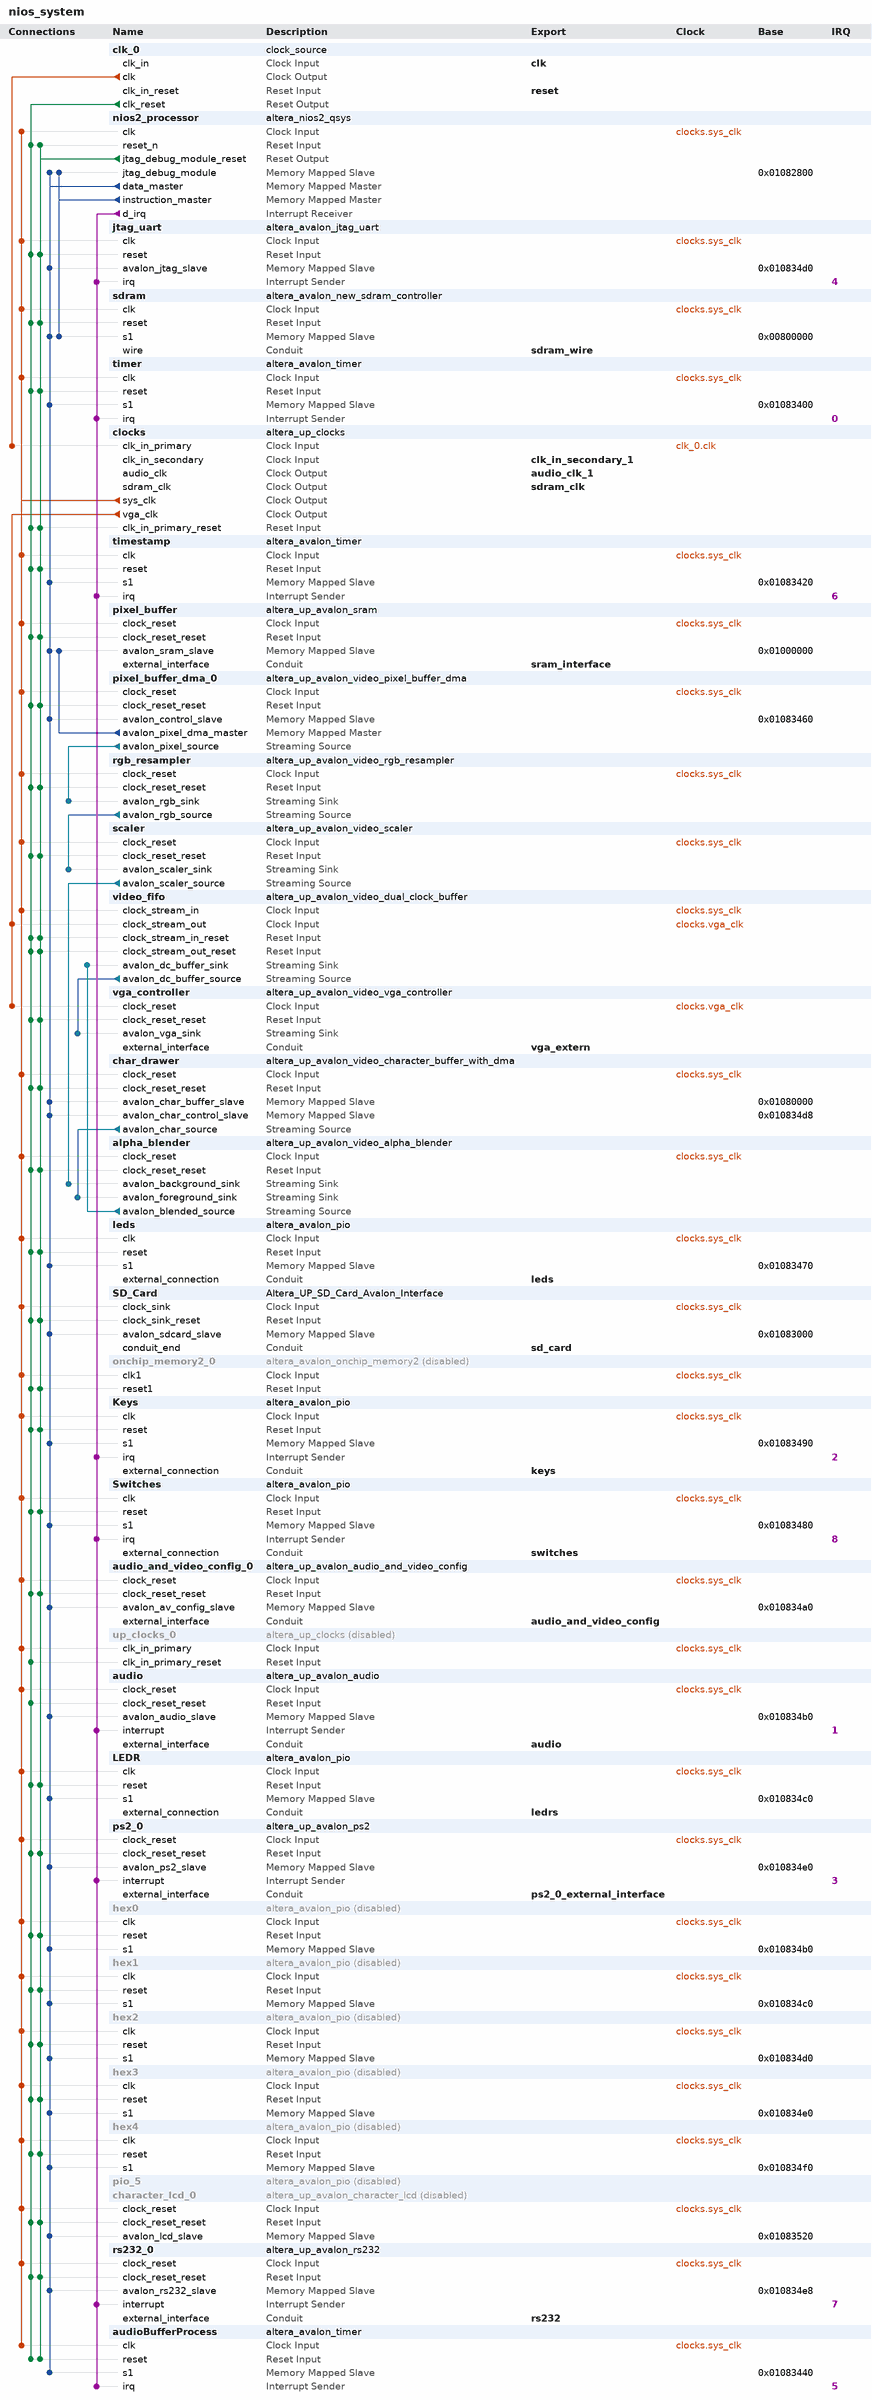
[diagram p0: system contents]
# Platform Designer (Qsys) system nios_system, Cyclone II EP2C35F672C6
# Parameters at their usual value, and those the tool derives, are not listed.
package require -exact qsys 12.0
create_system nios_system
set_project_property DEVICE_FAMILY {Cyclone II}
set_project_property DEVICE EP2C35F672C6

add_instance clk_0 clock_source 12.0
set_instance_parameter_value clk_0 clockFrequency 50000000

add_instance nios2_processor altera_nios2_qsys 12.0
set_instance_parameter_value nios2_processor resetSlave sdram.s1
set_instance_parameter_value nios2_processor exceptionSlave sdram.s1
set_instance_parameter_value nios2_processor breakSlave nios2_processor.jtag_debug_module
set_instance_parameter_value nios2_processor impl Fast
set_instance_parameter_value nios2_processor icache_size 8192
set_instance_parameter_value nios2_processor dcache_size 16384

add_instance jtag_uart altera_avalon_jtag_uart 12.0
set_instance_parameter_value jtag_uart simInteractiveOptions INTERACTIVE_ASCII_OUTPUT

add_instance sdram altera_avalon_new_sdram_controller 12.0
set_instance_parameter_value sdram TAC 5.5
set_instance_parameter_value sdram TRCD 20.0
set_instance_parameter_value sdram TRP 20.0
set_instance_parameter_value sdram casLatency 3
set_instance_parameter_value sdram columnWidth 8
set_instance_parameter_value sdram dataWidth 16
set_instance_parameter_value sdram generateSimulationModel false
set_instance_parameter_value sdram model custom
set_instance_parameter_value sdram numberOfBanks 4
set_instance_parameter_value sdram numberOfChipSelects 1
set_instance_parameter_value sdram powerUpDelay 100.0
set_instance_parameter_value sdram refreshPeriod 15.625
set_instance_parameter_value sdram rowWidth 12

add_instance timer altera_avalon_timer 12.0
set_instance_parameter_value timer period 1
set_instance_parameter_value timer periodUnits MSEC
set_instance_parameter_value timer timerPreset FULL_FEATURED

add_instance clocks altera_up_clocks 12.0
set_instance_parameter_value clocks board DE2
set_instance_parameter_value clocks vga_clk true
set_instance_parameter_value clocks audio_clk true
set_instance_parameter_value clocks audio_clk_freq 12.288

add_instance timestamp altera_avalon_timer 12.0
set_instance_parameter_value timestamp period 1
set_instance_parameter_value timestamp periodUnits MSEC
set_instance_parameter_value timestamp timerPreset FULL_FEATURED

add_instance pixel_buffer altera_up_avalon_sram 12.0
set_instance_parameter_value pixel_buffer board DE2
set_instance_parameter_value pixel_buffer pixel_buffer true

add_instance pixel_buffer_dma_0 altera_up_avalon_video_pixel_buffer_dma 12.0
set_instance_parameter_value pixel_buffer_dma_0 addr_mode Consecutive
set_instance_parameter_value pixel_buffer_dma_0 start_address 0
set_instance_parameter_value pixel_buffer_dma_0 back_start_address 0
set_instance_parameter_value pixel_buffer_dma_0 image_width 320
set_instance_parameter_value pixel_buffer_dma_0 image_height 240
set_instance_parameter_value pixel_buffer_dma_0 color_space {16-bit RGB}

add_instance rgb_resampler altera_up_avalon_video_rgb_resampler 12.0
set_instance_parameter_value rgb_resampler input_type {16-bit RGB}
set_instance_parameter_value rgb_resampler output_type {30-bit RGB}
set_instance_parameter_value rgb_resampler alpha 1023

add_instance scaler altera_up_avalon_video_scaler 12.0
set_instance_parameter_value scaler width_scaling 2
set_instance_parameter_value scaler height_scaling 2
set_instance_parameter_value scaler width_in 320
set_instance_parameter_value scaler color_bits 10
set_instance_parameter_value scaler color_planes 3

add_instance video_fifo altera_up_avalon_video_dual_clock_buffer 12.0
set_instance_parameter_value video_fifo color_bits 10

add_instance vga_controller altera_up_avalon_video_vga_controller 12.0
set_instance_parameter_value vga_controller board DE2

add_instance char_drawer altera_up_avalon_video_character_buffer_with_dma 12.0
set_instance_parameter_value char_drawer enable_transparency true

add_instance alpha_blender altera_up_avalon_video_alpha_blender 12.0

add_instance leds altera_avalon_pio 12.0
set_instance_parameter_value leds direction Output
set_instance_parameter_value leds width 8

add_instance SD_Card Altera_UP_SD_Card_Avalon_Interface 1.0

add_instance onchip_memory2_0 altera_avalon_onchip_memory2 12.0
set_instance_property onchip_memory2_0 ENABLED false
set_instance_parameter_value onchip_memory2_0 dataWidth 16
set_instance_parameter_value onchip_memory2_0 dualPort false
set_instance_parameter_value onchip_memory2_0 initMemContent true
set_instance_parameter_value onchip_memory2_0 initializationFileName onchip_memory2_0
set_instance_parameter_value onchip_memory2_0 memorySize 4096

add_instance Keys altera_avalon_pio 12.0
set_instance_parameter_value Keys captureEdge true
set_instance_parameter_value Keys direction Input
set_instance_parameter_value Keys edgeType ANY
set_instance_parameter_value Keys generateIRQ true
set_instance_parameter_value Keys irqType EDGE
set_instance_parameter_value Keys width 4

add_instance Switches altera_avalon_pio 12.0
set_instance_parameter_value Switches captureEdge true
set_instance_parameter_value Switches direction Input
set_instance_parameter_value Switches edgeType ANY
set_instance_parameter_value Switches generateIRQ true
set_instance_parameter_value Switches irqType EDGE
set_instance_parameter_value Switches width 8

add_instance audio_and_video_config_0 altera_up_avalon_audio_and_video_config 12.0
set_instance_parameter_value audio_and_video_config_0 board DE2
set_instance_parameter_value audio_and_video_config_0 audio_in {Microphone to ADC}
set_instance_parameter_value audio_and_video_config_0 line_in_bypass false
set_instance_parameter_value audio_and_video_config_0 bit_length 24
set_instance_parameter_value audio_and_video_config_0 sampling_rate {32 kHz}

add_instance up_clocks_0 altera_up_clocks 12.0
set_instance_property up_clocks_0 ENABLED false
set_instance_parameter_value up_clocks_0 board DE2
set_instance_parameter_value up_clocks_0 sdram_clk false
set_instance_parameter_value up_clocks_0 vga_clk false
set_instance_parameter_value up_clocks_0 audio_clk true
set_instance_parameter_value up_clocks_0 audio_clk_freq 12.288

add_instance audio altera_up_avalon_audio 12.0
set_instance_parameter_value audio avalon_bus_type {Memory Mapped}
set_instance_parameter_value audio audio_in true
set_instance_parameter_value audio dw 24

add_instance LEDR altera_avalon_pio 12.0
set_instance_parameter_value LEDR direction Output
set_instance_parameter_value LEDR width 18

add_instance ps2_0 altera_up_avalon_ps2 12.0

add_instance hex0 altera_avalon_pio 12.0
set_instance_property hex0 ENABLED false
set_instance_parameter_value hex0 direction Output
set_instance_parameter_value hex0 width 8

add_instance hex1 altera_avalon_pio 12.0
set_instance_property hex1 ENABLED false
set_instance_parameter_value hex1 direction Output
set_instance_parameter_value hex1 width 8

add_instance hex2 altera_avalon_pio 12.0
set_instance_property hex2 ENABLED false
set_instance_parameter_value hex2 direction Output
set_instance_parameter_value hex2 width 8

add_instance hex3 altera_avalon_pio 12.0
set_instance_property hex3 ENABLED false
set_instance_parameter_value hex3 direction Output
set_instance_parameter_value hex3 width 8

add_instance hex4 altera_avalon_pio 12.0
set_instance_property hex4 ENABLED false
set_instance_parameter_value hex4 direction Output
set_instance_parameter_value hex4 width 8

add_instance pio_5 altera_avalon_pio 12.0
set_instance_property pio_5 ENABLED false
set_instance_parameter_value pio_5 direction Output
set_instance_parameter_value pio_5 width 8

add_instance character_lcd_0 altera_up_avalon_character_lcd 12.0
set_instance_property character_lcd_0 ENABLED false
set_instance_parameter_value character_lcd_0 cursor Normal

add_instance rs232_0 altera_up_avalon_rs232 12.0
set_instance_parameter_value rs232_0 baud 115200
set_instance_parameter_value rs232_0 parity None

add_instance audioBufferProcess altera_avalon_timer 12.0
set_instance_parameter_value audioBufferProcess period 1
set_instance_parameter_value audioBufferProcess periodUnits MSEC
set_instance_parameter_value audioBufferProcess timerPreset FULL_FEATURED

# connections
add_connection clk_0.clk clocks.clk_in_primary clock
add_connection clocks.sys_clk alpha_blender.clock_reset clock
add_connection clocks.sys_clk audio.clock_reset clock
add_connection clocks.sys_clk audio_and_video_config_0.clock_reset clock
add_connection clocks.sys_clk audioBufferProcess.clk clock
add_connection clocks.sys_clk char_drawer.clock_reset clock
add_connection clocks.sys_clk character_lcd_0.clock_reset clock
add_connection clocks.sys_clk hex0.clk clock
add_connection clocks.sys_clk hex1.clk clock
add_connection clocks.sys_clk hex2.clk clock
add_connection clocks.sys_clk hex3.clk clock
add_connection clocks.sys_clk hex4.clk clock
add_connection clocks.sys_clk jtag_uart.clk clock
add_connection clocks.sys_clk Keys.clk clock
add_connection clocks.sys_clk LEDR.clk clock
add_connection clocks.sys_clk leds.clk clock
add_connection clocks.sys_clk nios2_processor.clk clock
add_connection clocks.sys_clk onchip_memory2_0.clk1 clock
add_connection clocks.sys_clk pixel_buffer.clock_reset clock
add_connection clocks.sys_clk pixel_buffer_dma_0.clock_reset clock
add_connection clocks.sys_clk ps2_0.clock_reset clock
add_connection clocks.sys_clk rgb_resampler.clock_reset clock
add_connection clocks.sys_clk rs232_0.clock_reset clock
add_connection clocks.sys_clk scaler.clock_reset clock
add_connection clocks.sys_clk SD_Card.clock_sink clock
add_connection clocks.sys_clk sdram.clk clock
add_connection clocks.sys_clk Switches.clk clock
add_connection clocks.sys_clk timer.clk clock
add_connection clocks.sys_clk timestamp.clk clock
add_connection clocks.sys_clk up_clocks_0.clk_in_primary clock
add_connection clocks.sys_clk video_fifo.clock_stream_in clock
add_connection clocks.vga_clk vga_controller.clock_reset clock
add_connection clocks.vga_clk video_fifo.clock_stream_out clock
add_connection clk_0.clk_reset alpha_blender.clock_reset_reset reset
add_connection clk_0.clk_reset audio.clock_reset_reset reset
add_connection clk_0.clk_reset audio_and_video_config_0.clock_reset_reset reset
add_connection clk_0.clk_reset audioBufferProcess.reset reset
add_connection clk_0.clk_reset char_drawer.clock_reset_reset reset
add_connection clk_0.clk_reset character_lcd_0.clock_reset_reset reset
add_connection clk_0.clk_reset clocks.clk_in_primary_reset reset
add_connection clk_0.clk_reset hex0.reset reset
add_connection clk_0.clk_reset hex1.reset reset
add_connection clk_0.clk_reset hex2.reset reset
add_connection clk_0.clk_reset hex3.reset reset
add_connection clk_0.clk_reset hex4.reset reset
add_connection clk_0.clk_reset jtag_uart.reset reset
add_connection clk_0.clk_reset Keys.reset reset
add_connection clk_0.clk_reset LEDR.reset reset
add_connection clk_0.clk_reset leds.reset reset
add_connection clk_0.clk_reset nios2_processor.reset_n reset
add_connection clk_0.clk_reset onchip_memory2_0.reset1 reset
add_connection clk_0.clk_reset pixel_buffer.clock_reset_reset reset
add_connection clk_0.clk_reset pixel_buffer_dma_0.clock_reset_reset reset
add_connection clk_0.clk_reset ps2_0.clock_reset_reset reset
add_connection clk_0.clk_reset rgb_resampler.clock_reset_reset reset
add_connection clk_0.clk_reset rs232_0.clock_reset_reset reset
add_connection clk_0.clk_reset scaler.clock_reset_reset reset
add_connection clk_0.clk_reset SD_Card.clock_sink_reset reset
add_connection clk_0.clk_reset sdram.reset reset
add_connection clk_0.clk_reset Switches.reset reset
add_connection clk_0.clk_reset timer.reset reset
add_connection clk_0.clk_reset timestamp.reset reset
add_connection clk_0.clk_reset up_clocks_0.clk_in_primary_reset reset
add_connection clk_0.clk_reset vga_controller.clock_reset_reset reset
add_connection clk_0.clk_reset video_fifo.clock_stream_in_reset reset
add_connection clk_0.clk_reset video_fifo.clock_stream_out_reset reset
add_connection nios2_processor.jtag_debug_module_reset alpha_blender.clock_reset_reset reset
add_connection nios2_processor.jtag_debug_module_reset audio_and_video_config_0.clock_reset_reset reset
add_connection nios2_processor.jtag_debug_module_reset audioBufferProcess.reset reset
add_connection nios2_processor.jtag_debug_module_reset char_drawer.clock_reset_reset reset
add_connection nios2_processor.jtag_debug_module_reset character_lcd_0.clock_reset_reset reset
add_connection nios2_processor.jtag_debug_module_reset clocks.clk_in_primary_reset reset
add_connection nios2_processor.jtag_debug_module_reset hex0.reset reset
add_connection nios2_processor.jtag_debug_module_reset hex1.reset reset
add_connection nios2_processor.jtag_debug_module_reset hex2.reset reset
add_connection nios2_processor.jtag_debug_module_reset hex3.reset reset
add_connection nios2_processor.jtag_debug_module_reset hex4.reset reset
add_connection nios2_processor.jtag_debug_module_reset jtag_uart.reset reset
add_connection nios2_processor.jtag_debug_module_reset Keys.reset reset
add_connection nios2_processor.jtag_debug_module_reset LEDR.reset reset
add_connection nios2_processor.jtag_debug_module_reset leds.reset reset
add_connection nios2_processor.jtag_debug_module_reset nios2_processor.reset_n reset
add_connection nios2_processor.jtag_debug_module_reset onchip_memory2_0.reset1 reset
add_connection nios2_processor.jtag_debug_module_reset pixel_buffer.clock_reset_reset reset
add_connection nios2_processor.jtag_debug_module_reset pixel_buffer_dma_0.clock_reset_reset reset
add_connection nios2_processor.jtag_debug_module_reset ps2_0.clock_reset_reset reset
add_connection nios2_processor.jtag_debug_module_reset rgb_resampler.clock_reset_reset reset
add_connection nios2_processor.jtag_debug_module_reset rs232_0.clock_reset_reset reset
add_connection nios2_processor.jtag_debug_module_reset scaler.clock_reset_reset reset
add_connection nios2_processor.jtag_debug_module_reset SD_Card.clock_sink_reset reset
add_connection nios2_processor.jtag_debug_module_reset sdram.reset reset
add_connection nios2_processor.jtag_debug_module_reset Switches.reset reset
add_connection nios2_processor.jtag_debug_module_reset timer.reset reset
add_connection nios2_processor.jtag_debug_module_reset timestamp.reset reset
add_connection nios2_processor.jtag_debug_module_reset vga_controller.clock_reset_reset reset
add_connection nios2_processor.jtag_debug_module_reset video_fifo.clock_stream_in_reset reset
add_connection nios2_processor.jtag_debug_module_reset video_fifo.clock_stream_out_reset reset
add_connection nios2_processor.data_master audio.avalon_audio_slave avalon
set_connection_parameter_value nios2_processor.data_master/audio.avalon_audio_slave baseAddress 0x010834b0
add_connection nios2_processor.data_master audio_and_video_config_0.avalon_av_config_slave avalon
set_connection_parameter_value nios2_processor.data_master/audio_and_video_config_0.avalon_av_config_slave baseAddress 0x010834a0
add_connection nios2_processor.data_master audioBufferProcess.s1 avalon
set_connection_parameter_value nios2_processor.data_master/audioBufferProcess.s1 baseAddress 0x01083440
add_connection nios2_processor.data_master char_drawer.avalon_char_buffer_slave avalon
set_connection_parameter_value nios2_processor.data_master/char_drawer.avalon_char_buffer_slave baseAddress 0x01080000
add_connection nios2_processor.data_master char_drawer.avalon_char_control_slave avalon
set_connection_parameter_value nios2_processor.data_master/char_drawer.avalon_char_control_slave baseAddress 0x010834d8
add_connection nios2_processor.data_master character_lcd_0.avalon_lcd_slave avalon
set_connection_parameter_value nios2_processor.data_master/character_lcd_0.avalon_lcd_slave baseAddress 0x01083520
add_connection nios2_processor.data_master hex0.s1 avalon
set_connection_parameter_value nios2_processor.data_master/hex0.s1 baseAddress 0x010834b0
add_connection nios2_processor.data_master hex1.s1 avalon
set_connection_parameter_value nios2_processor.data_master/hex1.s1 baseAddress 0x010834c0
add_connection nios2_processor.data_master hex2.s1 avalon
set_connection_parameter_value nios2_processor.data_master/hex2.s1 baseAddress 0x010834d0
add_connection nios2_processor.data_master hex3.s1 avalon
set_connection_parameter_value nios2_processor.data_master/hex3.s1 baseAddress 0x010834e0
add_connection nios2_processor.data_master hex4.s1 avalon
set_connection_parameter_value nios2_processor.data_master/hex4.s1 baseAddress 0x010834f0
add_connection nios2_processor.data_master jtag_uart.avalon_jtag_slave avalon
set_connection_parameter_value nios2_processor.data_master/jtag_uart.avalon_jtag_slave baseAddress 0x010834d0
add_connection nios2_processor.data_master Keys.s1 avalon
set_connection_parameter_value nios2_processor.data_master/Keys.s1 baseAddress 0x01083490
add_connection nios2_processor.data_master LEDR.s1 avalon
set_connection_parameter_value nios2_processor.data_master/LEDR.s1 baseAddress 0x010834c0
add_connection nios2_processor.data_master leds.s1 avalon
set_connection_parameter_value nios2_processor.data_master/leds.s1 baseAddress 0x01083470
add_connection nios2_processor.data_master nios2_processor.jtag_debug_module avalon
set_connection_parameter_value nios2_processor.data_master/nios2_processor.jtag_debug_module baseAddress 0x01082800
add_connection nios2_processor.data_master pixel_buffer.avalon_sram_slave avalon
set_connection_parameter_value nios2_processor.data_master/pixel_buffer.avalon_sram_slave baseAddress 0x01000000
add_connection nios2_processor.data_master pixel_buffer_dma_0.avalon_control_slave avalon
set_connection_parameter_value nios2_processor.data_master/pixel_buffer_dma_0.avalon_control_slave baseAddress 0x01083460
add_connection nios2_processor.data_master ps2_0.avalon_ps2_slave avalon
set_connection_parameter_value nios2_processor.data_master/ps2_0.avalon_ps2_slave baseAddress 0x010834e0
add_connection nios2_processor.data_master rs232_0.avalon_rs232_slave avalon
set_connection_parameter_value nios2_processor.data_master/rs232_0.avalon_rs232_slave baseAddress 0x010834e8
add_connection nios2_processor.data_master SD_Card.avalon_sdcard_slave avalon
set_connection_parameter_value nios2_processor.data_master/SD_Card.avalon_sdcard_slave baseAddress 0x01083000
add_connection nios2_processor.data_master sdram.s1 avalon
set_connection_parameter_value nios2_processor.data_master/sdram.s1 baseAddress 0x00800000
add_connection nios2_processor.data_master Switches.s1 avalon
set_connection_parameter_value nios2_processor.data_master/Switches.s1 baseAddress 0x01083480
add_connection nios2_processor.data_master timer.s1 avalon
set_connection_parameter_value nios2_processor.data_master/timer.s1 baseAddress 0x01083400
add_connection nios2_processor.data_master timestamp.s1 avalon
set_connection_parameter_value nios2_processor.data_master/timestamp.s1 baseAddress 0x01083420
add_connection nios2_processor.instruction_master nios2_processor.jtag_debug_module avalon
set_connection_parameter_value nios2_processor.instruction_master/nios2_processor.jtag_debug_module baseAddress 0x01082800
add_connection nios2_processor.instruction_master sdram.s1 avalon
set_connection_parameter_value nios2_processor.instruction_master/sdram.s1 baseAddress 0x00800000
add_connection pixel_buffer_dma_0.avalon_pixel_dma_master pixel_buffer.avalon_sram_slave avalon
set_connection_parameter_value pixel_buffer_dma_0.avalon_pixel_dma_master/pixel_buffer.avalon_sram_slave baseAddress 0x01000000
add_connection alpha_blender.avalon_blended_source video_fifo.avalon_dc_buffer_sink avalon_streaming
add_connection char_drawer.avalon_char_source alpha_blender.avalon_foreground_sink avalon_streaming
add_connection pixel_buffer_dma_0.avalon_pixel_source rgb_resampler.avalon_rgb_sink avalon_streaming
add_connection rgb_resampler.avalon_rgb_source scaler.avalon_scaler_sink avalon_streaming
add_connection scaler.avalon_scaler_source alpha_blender.avalon_background_sink avalon_streaming
add_connection video_fifo.avalon_dc_buffer_source vga_controller.avalon_vga_sink avalon_streaming
add_connection nios2_processor.d_irq audio.interrupt interrupt
set_connection_parameter_value nios2_processor.d_irq/audio.interrupt irqNumber 1
add_connection nios2_processor.d_irq audioBufferProcess.irq interrupt
set_connection_parameter_value nios2_processor.d_irq/audioBufferProcess.irq irqNumber 5
add_connection nios2_processor.d_irq jtag_uart.irq interrupt
set_connection_parameter_value nios2_processor.d_irq/jtag_uart.irq irqNumber 4
add_connection nios2_processor.d_irq Keys.irq interrupt
set_connection_parameter_value nios2_processor.d_irq/Keys.irq irqNumber 2
add_connection nios2_processor.d_irq ps2_0.interrupt interrupt
set_connection_parameter_value nios2_processor.d_irq/ps2_0.interrupt irqNumber 3
add_connection nios2_processor.d_irq rs232_0.interrupt interrupt
set_connection_parameter_value nios2_processor.d_irq/rs232_0.interrupt irqNumber 7
add_connection nios2_processor.d_irq Switches.irq interrupt
set_connection_parameter_value nios2_processor.d_irq/Switches.irq irqNumber 8
add_connection nios2_processor.d_irq timer.irq interrupt
set_connection_parameter_value nios2_processor.d_irq/timer.irq irqNumber 0
add_connection nios2_processor.d_irq timestamp.irq interrupt
set_connection_parameter_value nios2_processor.d_irq/timestamp.irq irqNumber 6

# exported interfaces
add_interface clk clock sink
set_interface_property clk EXPORT_OF clk_0.clk_in
add_interface reset reset sink
set_interface_property reset EXPORT_OF clk_0.clk_in_reset
add_interface sdram_wire conduit end
set_interface_property sdram_wire EXPORT_OF sdram.wire
add_interface sram_interface conduit end
set_interface_property sram_interface EXPORT_OF pixel_buffer.external_interface
add_interface vga_extern conduit end
set_interface_property vga_extern EXPORT_OF vga_controller.external_interface
add_interface sdram_clk clock source
set_interface_property sdram_clk EXPORT_OF clocks.sdram_clk
add_interface leds conduit end
set_interface_property leds EXPORT_OF leds.external_connection
add_interface sd_card conduit end
set_interface_property sd_card EXPORT_OF SD_Card.conduit_end
add_interface keys conduit end
set_interface_property keys EXPORT_OF Keys.external_connection
add_interface switches conduit end
set_interface_property switches EXPORT_OF Switches.external_connection
add_interface audio_and_video_config conduit end
set_interface_property audio_and_video_config EXPORT_OF audio_and_video_config_0.external_interface
add_interface audio conduit end
set_interface_property audio EXPORT_OF audio.external_interface
add_interface ledrs conduit end
set_interface_property ledrs EXPORT_OF LEDR.external_connection
add_interface ps2_0_external_interface conduit end
set_interface_property ps2_0_external_interface EXPORT_OF ps2_0.external_interface
add_interface rs232 conduit end
set_interface_property rs232 EXPORT_OF rs232_0.external_interface
add_interface audio_clk_1 clock source
set_interface_property audio_clk_1 EXPORT_OF clocks.audio_clk
add_interface clk_in_secondary_1 clock sink
set_interface_property clk_in_secondary_1 EXPORT_OF clocks.clk_in_secondary

save_system nios_system.qsys
